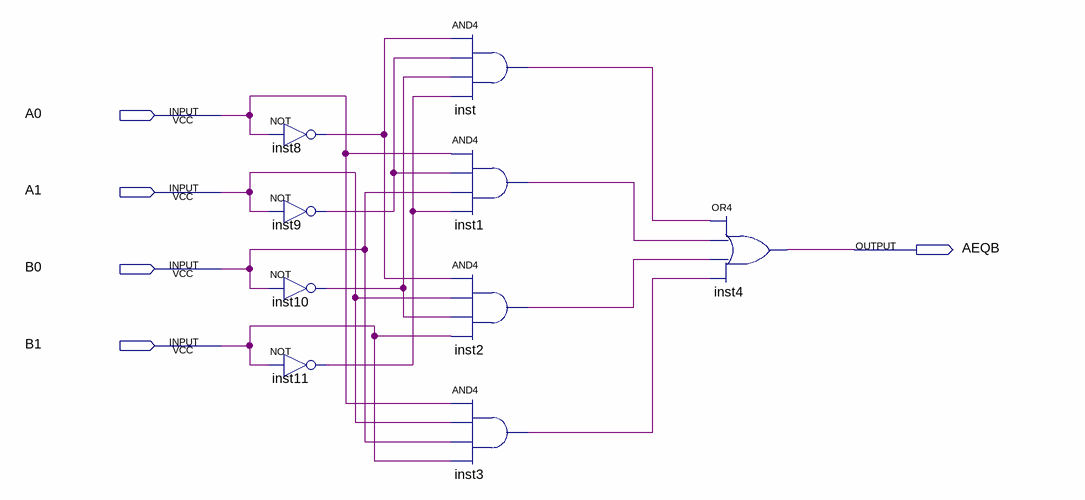
[diagram p0: schematic sheet]
// Quartus schematic AEQB.bdf as structural Verilog: 9 symbols, 5 pins
module AEQB (
  input  A0,
  input  A1,
  input  B0,
  input  B1,
  output AEQB
);

  wire inst1_out, inst2_out, inst3_out, inst8_out, inst9_out, inst10_out, inst11_out, inst_out;

  not inst8 (inst8_out, A0);
  not inst9 (inst9_out, A1);
  not inst10 (inst10_out, B0);
  not inst11 (inst11_out, B1);
  and inst (inst_out, inst8_out, inst9_out, inst10_out, inst11_out);
  and inst1 (inst1_out, A0, inst9_out, B0, inst11_out);
  and inst2 (inst2_out, inst8_out, A1, inst10_out, B1);
  and inst3 (inst3_out, A0, A1, B0, B1);
  or inst4 (AEQB, inst_out, inst1_out, inst2_out, inst3_out);
endmodule
